# EAGLE design Zio DC-DC Booster (EAGLE 8.7.1)
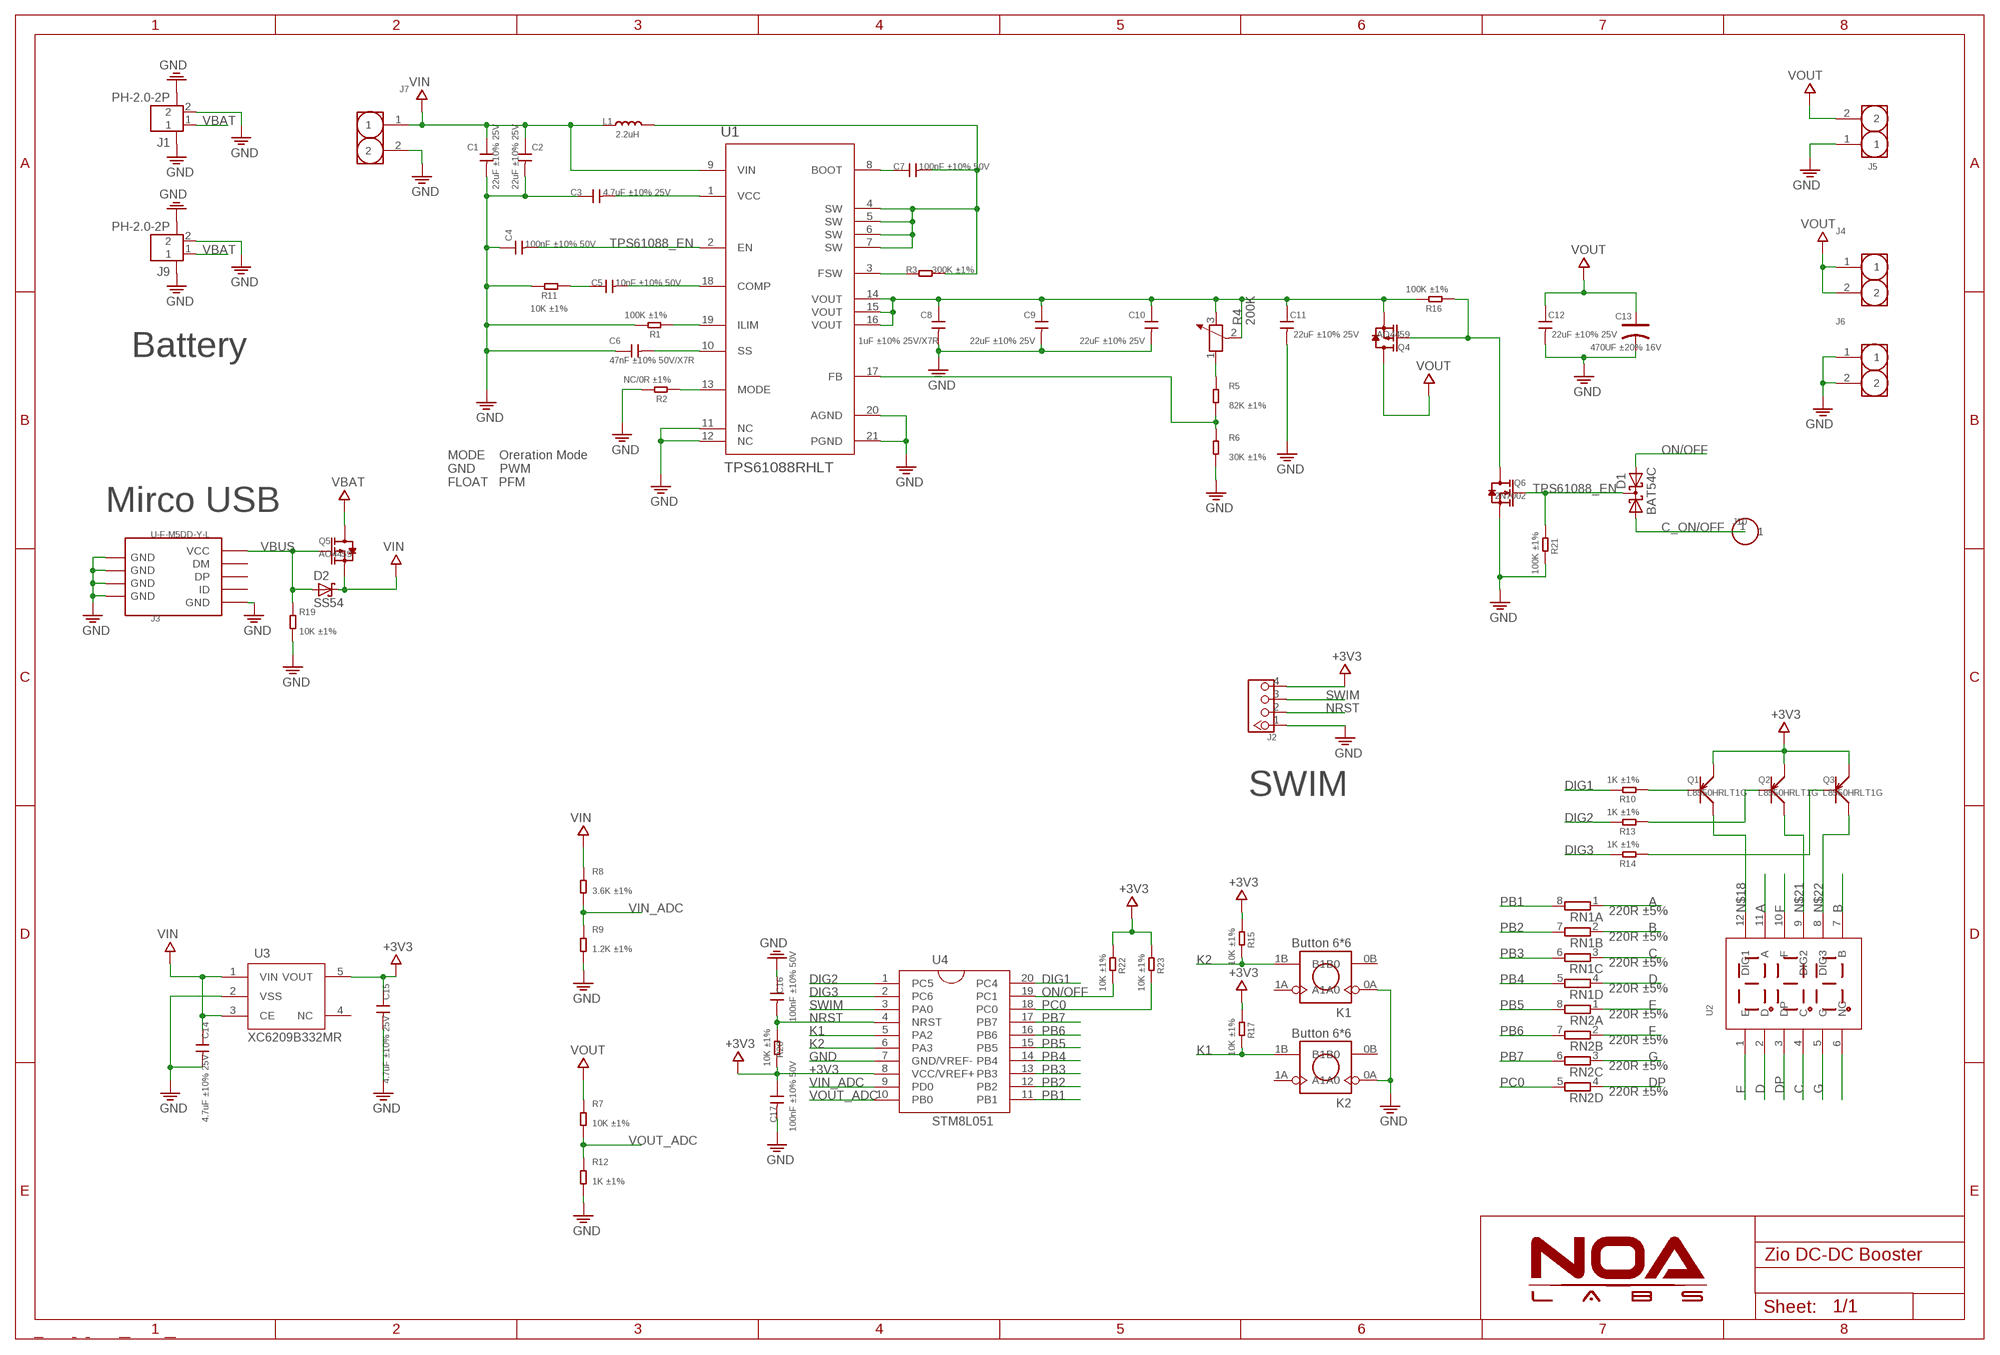
[diagram p0: schematic, sheet 1]

## Parts
C1  22uF ±10% 25V  C-1206  [1206]
C2  22uF ±10% 25V  C-1206  [1206]
C3  4.7uF ±10% 25V  C-0603  [0603]
C4  100nF ±10% 50V  C-0603  [0603]
C5  10nF ±10% 50V  C-0603  [0603]
C6  47nF ±10% 50V/X7R  C-0603  [0603]
C7  100nF ±10% 50V  C-0603  [0603]
C8  1uF ±10% 25V/X7R  C-0603  [0603]
C9  22uF ±10% 25V  C-1206  [1206]
C10  22uF ±10% 25V  C-1206  [1206]
C11  22uF ±10% 25V  C-1206  [1206]
C12  22uF ±10% 25V  C-1206  [1206]
C13  470UF ±20% 16V  CAP-ELECTRO-E  [ELECTRO-SMD-E-7.8MM]
C14  4.7uF ±10% 25V  C-0603  [0603]
C15  4.7uF ±10% 25V  C-0603  [0603]
C16  100nF ±10% 50V  C-0603  [0603]
C17  100nF ±10% 50V  C-0603  [0603]
D1  BAT54C  [SOT23]
D2  SS54  SCHOTTKY  [SMA]
J1  PH-2.0-2P  [PH-2.0-2P]
J2  HEADER-4P-TEST_3.08_4P  [TEST_3.08_4P]
J3  U-F-M5DD-Y-L  USB-MICROE  [MICRO-SMD]
J4  HEADER-2P-65/35MIL  [2P-2.54-65/35MIL]
J5  HEADER-2P-SCREW5.0  [2P-SCREW-5.0]
J6  HEADER-2P-65/35MIL  [2P-2.54-65/35MIL]
J7  HEADER-2P-SCREW5.0  [2P-SCREW-5.0]
J9  PH-2.0-2P  [PH-2.0-2P]
J10  HEADER-1P  [1P-40MIL]
K1  Button 6*6  BOTTON-4P-6X6  [4P-SMD-6X6]
K2  Button 6*6  BOTTON-4P-6X6  [4P-SMD-6X6]
L1  2.2uH  L-10.5*11.5  [L-10.5*11.5]
Q1  L8550HRLT1G  TRANSISTOR-PNP-SOT23  [SOT23]
Q2  L8550HRLT1G  TRANSISTOR-PNP-SOT23  [SOT23]
Q3  L8550HRLT1G  TRANSISTOR-PNP-SOT23  [SOT23]
Q4  AO4459  MOSFET-P-AO4459  [SOP08]
Q5  AO4459  MOSFET-P-AO4459  [SOP08]
Q6  2N7002  MOSFET-N-SOT23  [SOT23]
R1  100K ±1%  R  [0603]
R2  NC/0R ±1%  R-0402  [0402]
R3  300K ±1%  R  [0603]
R4  200K  R-POTENTIOMETER'3362'  [3P-SQUA-7X6.8]
R5  82K ±1%  R  [0603]
R6  30K ±1%  R  [0603]
R7  10K ±1%  R  [0603]
R8  3.6K ±1%  R  [0603]
R9  1.2K ±1%  R  [0603]
R10  1K ±1%  R  [0603]
R11  10K ±1%  R  [0603]
R12  1K ±1%  R  [0603]
R13  1K ±1%  R  [0603]
R14  1K ±1%  R  [0603]
R15  10K ±1%  R  [0603]
R16  100K ±1%  R  [0603]
R17  10K ±1%  R  [0603]
R19  10K ±1%  R  [0603]
R20  10K ±1%  R-0603  [0603]
R21  100K ±1%  R  [0603]
R22  10K ±1%  R  [0603]
R23  10K ±1%  R  [0603]
RN1  220R ±5%  RESISTOR-DIL_4R-N0603-ARC  [RESISTOR-DIL_0603-ARC]
RN2  220R ±5%  RESISTOR-DIL_4R-N0603-ARC  [RESISTOR-DIL_0603-ARC]
U1  TPS61088RHLT  IC_TPS61088RHLR  [IC_RHL0020A]
U2  SEGMENT_ANODES_3_0.28  [SEGMENT_ANODES_3_0.28]
U3  XC6209B332MR  XC6210  [SOT23-5]
U4  STM8L051  [TSSOP20]

## Nets
+3V3: C15.1 C17.1 J2.4 Q1.2(E) Q2.2(E) Q3.2(E) R15.2 R17.2 R20.2 R22.2 R23.2 U3.5(VOUT) U4.8(VCC/VREF+)
A: RN1.1 U2.11(A)
B: RN1.2 U2.7(B)
C: RN1.3 U2.4(C)
C_ON/OFF: D1.1(A1) J10.1
D: RN1.4 U2.2(D)
DIG1: R10.1 U4.20(PC4)
DIG2: R13.1 U4.1(PC5)
DIG3: R14.1 U4.2(PC6)
DP: RN2.4 U2.3(DP)
E: RN2.1 U2.1(E)
F: RN2.2 U2.10(F)
G: RN2.3 U2.5(G)
GND: C1.2 C2.2 C3.1 C4.1 C6.1 C8.2 C9.2 C10.2 C11.2 C12.2 C13.- C14.2 C15.2 C16.1 C17.2 J1.2 J1.7 J1.8 J2.1 J3.GND J3.S1(GND) J3.S1@1(GND) J3.S1@2(GND) J3.S2(GND) J3.S2@1(GND) J3.S2@2(GND) J3.S3(GND) J3.S3@1(GND) J3.S3@2(GND) J3.S4(GND) J3.S4@1(GND) J3.S4@2(GND) J5.1 J6.1 J6.2 J7.2 J9.2 J9.7 J9.8 K1.0A(A0) K2.0A(A0) Q6.2(S) R1.1 R2.1 R6.2 R9.1 R11.1 R12.1 R19.2 R21.1 U1.11(NC) U1.12(NC) U1.20(AGND) U1.21(PGND) U3.2(VSS) U4.7(GND/VREF-)
K1: K2.1B(B1) R17.1 U4.5(PA2)
K2: K1.1B(B1) R15.1 U4.6(PA3)
N$2: R4.1 R5.1
N$3: Q1.1(B) R10.2
N$4: Q2.1(B) R13.2
N$5: Q3.1(B) R14.2
N$6: Q4.4(G) Q6.3(D) R16.2
N$12: C5.1 R11.2
N$13: C5.2 U1.18(COMP)
N$17: U2.6(NC)
N$18: Q1.3(C) U2.12(DIG1)
N$21: Q2.3(C) U2.9(DIG2)
N$22: Q3.3(C) U2.8(DIG3)
N$30: C3.2 U1.1(VCC)
N$32: C7.1 U1.8(BOOT)
N$35: R3.1 U1.3(FSW)
N$38: R5.2 R6.1 U1.17(FB)
N$41: R2.2 U1.13(MODE)
N$43: C6.2 U1.10(SS)
N$45: R1.2 U1.19(ILIM)
NRST: C16.2 J2.2 R20.1 U4.4(NRST)
ON/OFF: D1.2(A2) R22.1 U4.19(PC1)
PB1: RN1.8 U4.11(PB1)
PB2: RN1.7 U4.12(PB2)
PB3: RN1.6 U4.13(PB3)
PB4: RN1.5 U4.14(PB4)
PB5: RN2.8 U4.15(PB5)
PB6: RN2.7 U4.16(PB6)
PB7: RN2.6 U4.17(PB7)
PC0: R23.1 RN2.5 U4.18(PC0)
SW: C7.2 L1.2 R3.2 U1.4(SW) U1.5(SW) U1.6(SW) U1.7(SW)
SWIM: J2.3 U4.3(PA0)
TPS61088_EN: C4.2 D1.3(CC) Q6.1(G) R21.2 U1.2(EN)
V_OUT: C8.1 C9.1 C10.1 C11.1 Q4.1(S) Q4.2(S) Q4.3(S) R4.2 R4.3 R16.1 U1.14(VOUT) U1.15(VOUT) U1.16(VOUT)
VBAT: J1.1 J9.1 Q5.5(D) Q5.6(D) Q5.7(D) Q5.8(D)
VBUS: D2.P$2(A) J3.VBUS(VCC) Q5.4(G) R19.1
VIN: C1.1 C2.1 C14.1 D2.P$1(C) J7.1 L1.1 Q5.1(S) Q5.2(S) Q5.3(S) R8.2 U1.9(VIN) U3.1(VIN) U3.3(CE)
VIN_ADC: R8.1 R9.2 U4.9(PD0)
VOUT: C12.1 C13.+ J4.1 J4.2 J5.2 Q4.5(D) Q4.6(D) Q4.7(D) Q4.8(D) R7.2
VOUT_ADC: R7.1 R12.2 U4.10(PB0)
Unconnected: J3.D+(DP) J3.D-(DM) J3.ID K1.0B(B0) K1.1A(A1) K2.0B(B0) K2.1A(A1) U3.4(NC)

## Notes on the sheet
- Battery
- MODE    Oreration Mode
  GND       PWM
  FLOAT   PFM
- Mirco USB
- SWIM

## Library data of the parts
C1-C12 C14 C15 = Discrete:C*: Ceramic Capacitors
C13 = Discrete:CAP*: Electrolytic Capacitors,Tantalum Capacitors and Super Capacitors
C16 C17 = Discretex:C*: Ceramic Capacitors
D1 = diode:BAT54C: Schottky Diodes Source: Fairchild .. BAT54.pdf
D2 = Discrete:SCHOTTKY
J1 J9 = Connector:PH-2.0-2P
J2 = Connector:HEADER-4P
J3 = Connector:USB-MICROE
J4-J7 = Connector:HEADER-2P
J10 = Connector:HEADER-1P
K1 K2 = Discrete:BOTTON-4P
L1 = Discretex:L*
Q1-Q3 = Discretex:TRANSISTOR-PNP*: PNP audion
Q4 Q5 = Discretex:MOSFET-P
Q6 = Discretex:MOSFET-N
R1-R3 R5-R17 R19 R21-R23 = Discrete:R*
R4 = Discrete:R-POTENTIOMETER*: Potentiometer
R20 = Discretex:R*
RN1 RN2 = A:RESISTOR-DIL_4R-N: Array Chip Resistor Source: RS Component / Phycomp
U1 = IC:IC_TPS61088RHLR; ALTERNATEPARTNUMBER: TPS61088RHLT; APPLICATION_BUILDNUMBER: *; COMPTYPE: IC; MANUFACTURER: Texas Instruments; MOUNTTYPE: SMT; PACKAGEREFERENCE: RHL0020A; PARTNUMBER: TPS61088RHLR; PIN_COUNT: 21; REFDES: RefDes; ROHS: Y; TYPE: TYPE; VALUE: Value
U2 = Discretex:SEGMENT_ANODES_3_0.28
U3 = IC:XC6210
U4 = IC:STM8L051

## Board
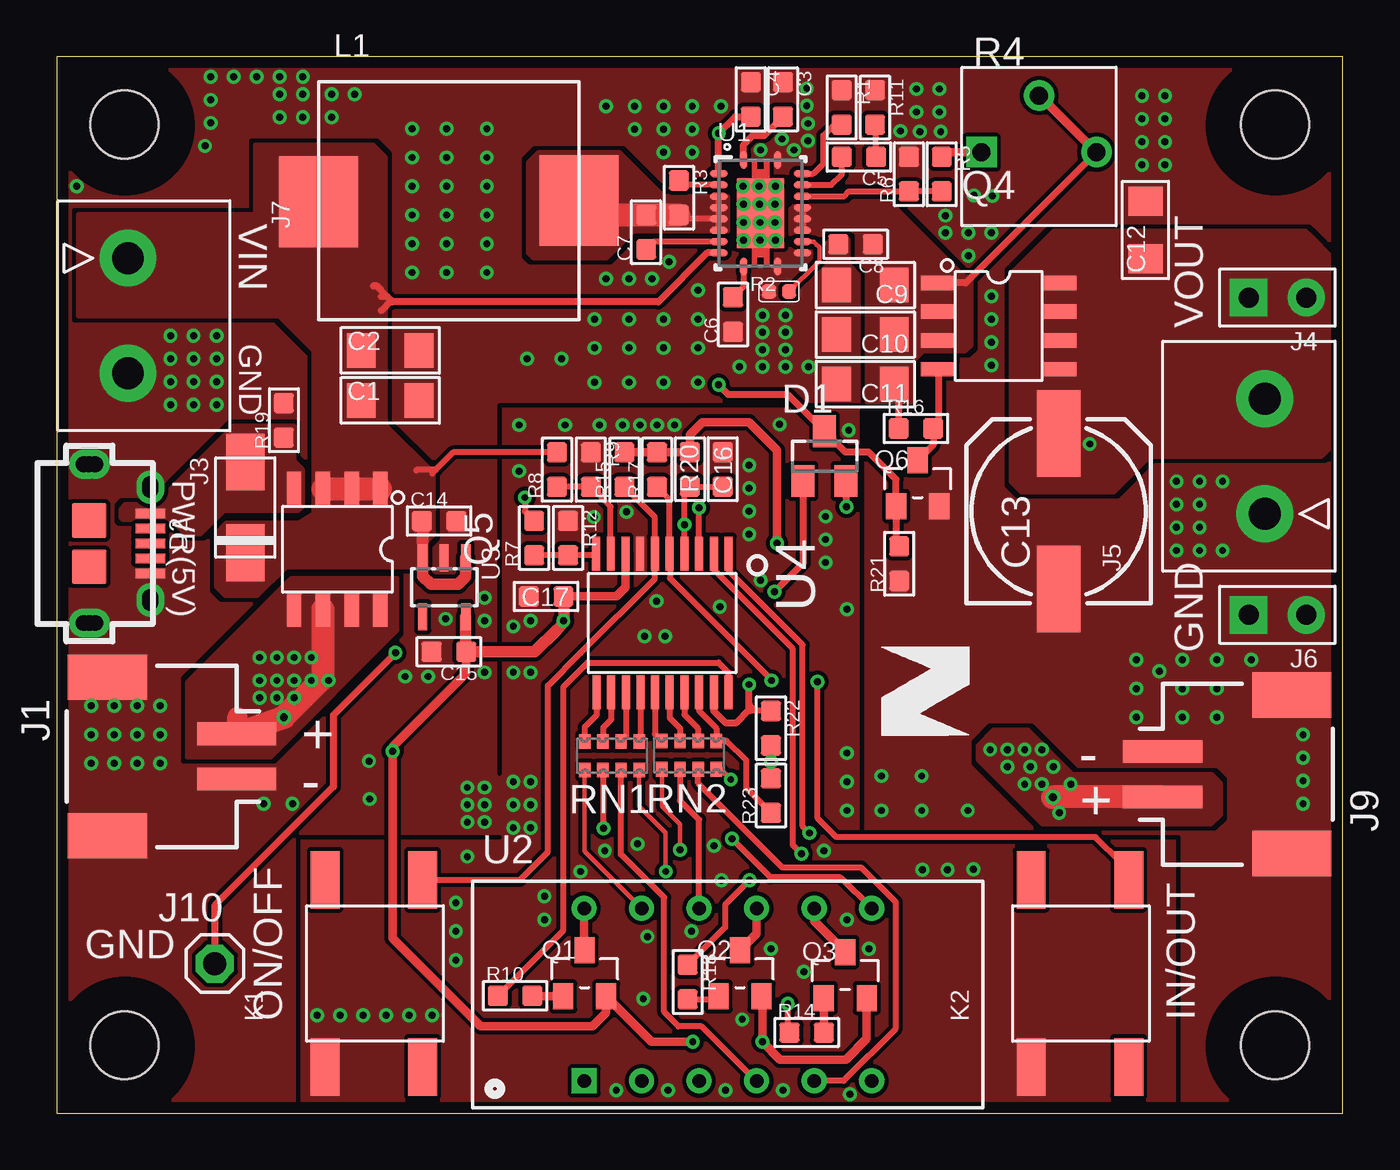
[diagram p1: board, top side]
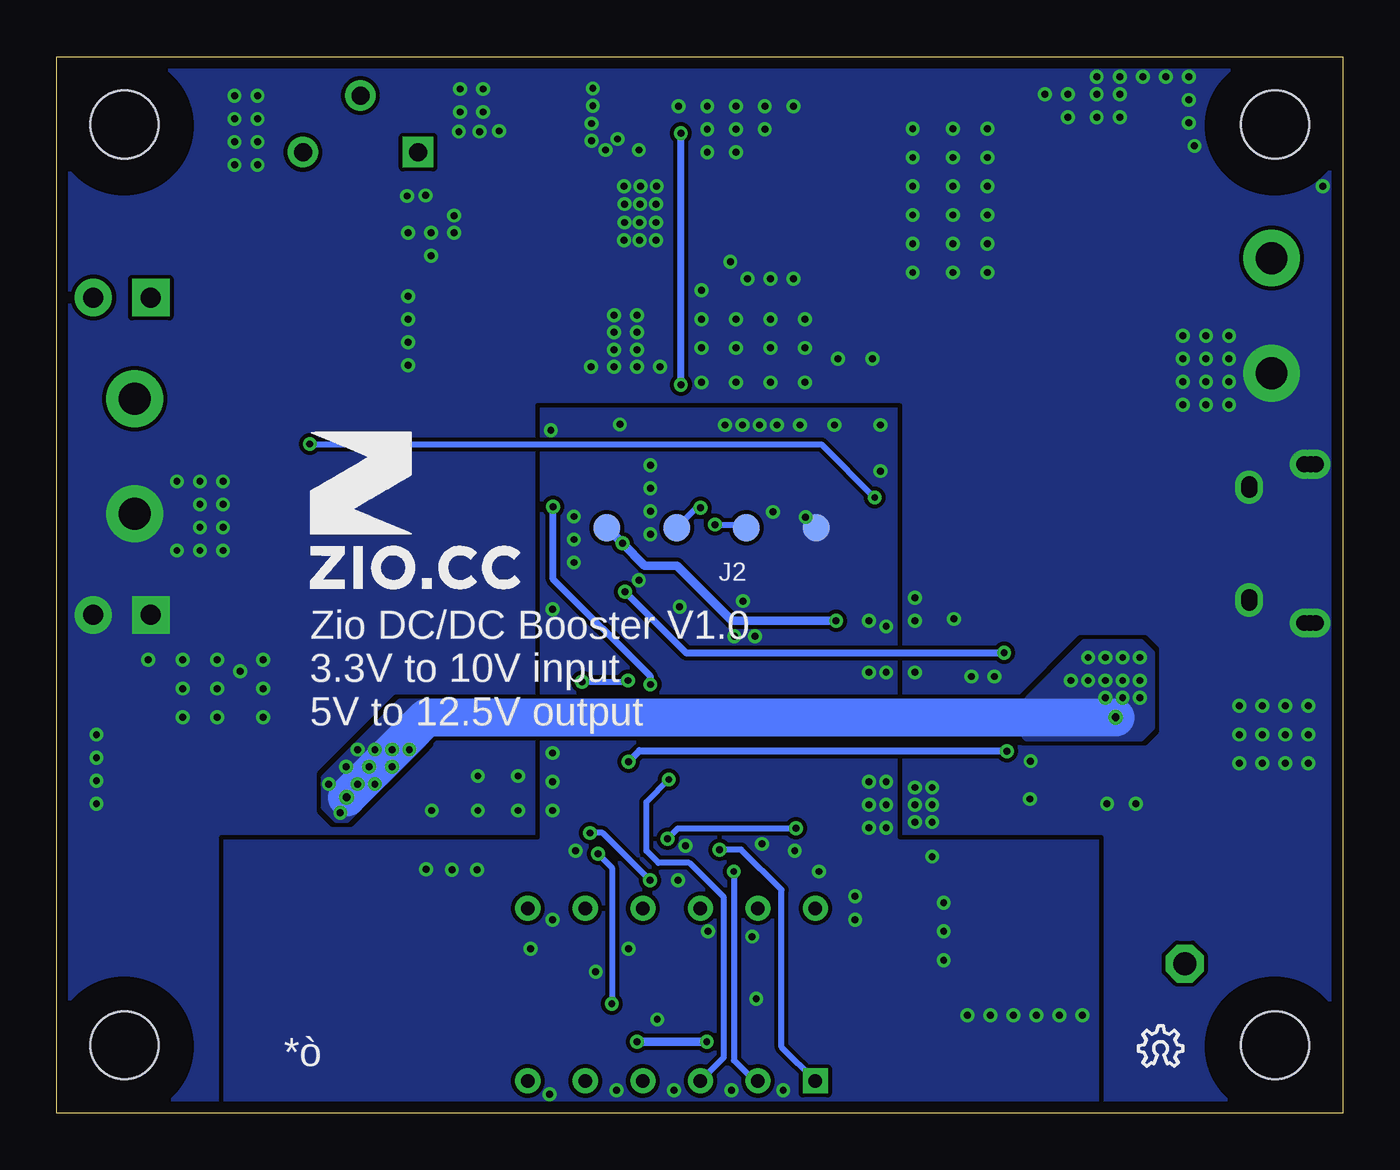
[diagram p2: board, bottom side, seen from below]

Size 56.8 x 46.64 mm. Coordinates in mm from the lower left corner, seen from the top.
Outline: 0,0 56.8,0 56.8,46.64 0,46.64 0,0
Copper layers (1*16): Top 0.035mm / dielectric 1.5mm / Bottom 0.035mm
Design rules "NOA Eagle Rule": minimum track width 7mil, minimum drill 12mil, track to track 7mil, track to pad 7mil, pad to pad 7mil, via to via 7mil, smd to smd 0mil, copper to edge 20mil, drill to drill 10mil, minimum pad ring 10mil, minimum via ring 6mil, stop-mask expansion 2mil, vias tented up to drill 25mil, thermal gap 10mil
Holes 3 mm at 3,3 53.8,3 3,43.64 53.8,43.64
tRestrict: area 0,40.6 to 6,46.6; area 0,-0.1 to 6,5.9; area 50.8,40.6 to 56.8,46.6; area 50.8,-0.1 to 56.8,5.9; 8 lines
bRestrict: area 0,-0.1 to 6,5.9; area 0,40.6 to 6,46.6; area 50.8,40.6 to 56.8,46.6; area 50.8,-0.1 to 56.8,5.9; 8 lines

### Footprints (pad centres in the part's own frame; a part is rotated, then mirrored left to right if it is on the bottom)
1206 = smd 1.27 x 1.524: 1 -1.27,0; 2 1.27,0
0603 = smd 0.889 x 0.889: 1 -0.762,0; 2 0.762,0
ELECTRO-SMD-E-7.8MM = smd 3.81 x 1.905: + 3.429,0; - -3.429,0
SOT23 = smd 1 x 1.4: 1 -0.95,-1.1; 2 0.95,-1.1; 3 0,1.1
SMA = smd 2.5 x 1.7: P$1 -2,0; P$2 2,0
PH-2.0-2P = smd 1 x 3.5: 1 -1,0; 2 1,0 | smd 2 x 3.5: 7 -3.5,-5.7; 8 3.5,-5.7
TEST_3.08_4P = smd 1.2 x 1.2: 1 -4.62,0; 2 -1.54,0; 3 1.54,0; 4 4.62,0
MICRO-SMD = smd 0.406 x 1.346: D+ 0,2.057; D- -0.66,2.057; GND 1.321,2.057; ID 0.66,2.057; VBUS -1.321,2.057 | drill 0.7: S1 -2.489,2.057; S1@1 -2.616,2.057; S1@2 -2.362,2.057; S2 2.464,2.057; S2@1 2.362,2.057; S2@2 2.616,2.057 | drill 0.7 pad 1.27: S3 -3.505,-0.66; S3@1 -3.505,-0.381; S3@2 -3.505,-0.889; S4 3.505,-0.635; S4@1 3.505,-0.381; S4@2 3.505,-0.889 | smd 1.524 x 1.524: S5 -1.016,-0.635; S6 1.016,-0.635
2P-2.54-65/35MIL = drill 0.889 pad 1.651 square: 1 0,1.27 | drill 0.889 pad 1.651: 2 0,-1.27
2P-SCREW-5.0 = drill 1.4 pad 2.5: 1 -2.54,0; 2 2.54,0
1P-40MIL = drill 1.016 pad 1.676 octagon: 1 0,0
4P-SMD-6X6 = smd 2.54 x 1.27: 0A -4.129,2.205; 0B 4.129,2.205; 1A -4.129,-2.105; 1B 4.129,-2.105
L-10.5*11.5 = smd 3.5 x 4: 1 -5.75,-0.05; 2 5.75,0
SOT23' = smd 0.889 x 1.143: 1 -0.95,-1.016; 2 0.95,-1.016; 3 0,1.016
SOP08 = smd 0.635 x 1.524: 1 -1.905,-2.667; 2 -0.635,-2.667; 3 0.635,-2.667; 4 1.905,-2.667; 5 1.905,2.667; 6 0.635,2.667; 7 -0.635,2.667; 8 -1.905,2.667
0402 = smd 0.635 x 0.635: 1 -0.445,0; 2 0.445,0
3P-SQUA-7X6.8 = drill 0.8 pad 1.35 square: 1 -2.54,-0.25 | drill 0.8 pad 1.35: 2 0,2.25; 3 2.54,-0.25
RESISTOR-DIL_0603-ARC = smd 0.5 x 0.65: 1 -1.2,-0.625; 2 -0.4,-0.625; 3 0.4,-0.625; 4 1.2,-0.625; 5 1.2,0.625; 6 0.4,0.625; 7 -0.4,0.625; 8 -1.2,0.625
IC_RHL0020A = smd 0.32 x 0.8: 1 -0.75,2.35; 10 -0.75,-2.35; 11 0.75,-2.35; 20 0.75,2.35 | smd 0.8 x 0.32: 2 -1.85,1.75; 3 -1.85,1.25; 4 -1.85,0.75; 5 -1.85,0.25; 6 -1.85,-0.25; 7 -1.85,-0.75; 8 -1.85,-1.25; 9 -1.85,-1.75; 12 1.85,-1.75; 13 1.85,-1.25; 14 1.85,-0.75; 15 1.85,-0.25; 16 1.85,0.25; 17 1.85,0.75; 18 1.85,1.25; 19 1.85,1.75 | smd 2.083 x 3.048: 21 0,0
SEGMENT_ANODES_3_0.28 = drill 0.6 square: 1 0,0 | drill 0.6: 2 2.54,0; 3 5.08,0; 4 7.62,0; 5 10.16,0; 6 12.7,0; 7 12.7,7.62; 8 10.16,7.62; 9 7.62,7.62; 10 5.08,7.62; 11 2.54,7.62; 12 0,7.62
SOT23-5 = smd 0.4 x 1.2: 1 -0.95,-1.3; 2 0,-1.3; 3 0.95,-1.3; 4 0.95,1.3; 5 -0.95,1.3
TSSOP20 = smd 0.35 x 1.5: 1 -2.925,-3.065; 2 -2.275,-3.065; 3 -1.625,-3.065; 4 -0.975,-3.065; 5 -0.325,-3.065; 6 0.325,-3.065; 7 0.975,-3.065; 8 1.625,-3.065; 9 2.275,-3.065; 10 2.925,-3.065; 11 2.91,3.065; 12 2.26,3.065; 13 1.61,3.065; 14 0.96,3.065; 15 0.325,3.065; 16 -0.325,3.065; 17 -0.975,3.065; 18 -1.625,3.065; 19 -2.275,3.065; 20 -2.925,3.065

### Placement (x,y rotation side)
C1  14.73,31.47 0 top
C2  14.73,33.68 0 top
C3  32.08,44.75 270 top
C4  30.65,44.75 270 top
C5  35.43,42.21 180 top
C6  29.87,35.25 90 top
C7  26.03,38.89 90 top
C8  35.28,38.36 180 top
C9  35.71,36.55 180 top
C10  35.71,34.37 180 top
C11  35.71,32.19 180 top
C12  48.08,38.99 90 top
C13  44.25,26.57 90 top
C14  16.89,26.14 0 top
C15  17.32,20.37 180 top
C16  29.41,28.42 270 top
C17  21.62,22.81 180 top
D1  33.91,29.01 0 top
D2  8.33,26.74 90 top
J1  7.95,15.75 270 top
J2  27.88,25.84 180 bottom
J3  2.08,25.15 270 top
J4  53.91,36 90 top
J5  53.35,29 90 top
J6  53.91,22 90 top
J7  3.15,35.2 270 top
J9  48.84,14.96 90 top
J10  6.99,6.6 0 top
K1  14.06,6.17 90 top
K2  45.24,6.17 90 top
L1  17.32,40.28 0 top
LOGO1  LOGO-OSHW-6MILX0070-NT  [OSHW_6X70_NOTEXT]  9.04,2.08 0 bottom
Q1  L8550HRLT1G  [SOT23']  23.32,6.17 0 top
Q2  L8550HRLT1G  [SOT23']  30.18,6.17 0 top
Q3  L8550HRLT1G  [SOT23']  34.83,6.1 0 top
Q4  41.61,34.75 270 top
Q5  12.4,24.89 180 top
Q6  2N7002  [SOT23']  38.02,27.81 0 top
R1  34.67,44.4 270 top
R2  31.9,36.27 0 top
R3  27.48,40.41 270 top
R4  43.38,42.67 0 top
R5  39.09,41.45 270 top
R6  37.64,41.45 90 top
R7  21.09,25.39 90 top
R8  22.09,28.41 90 top
R9  23.59,28.41 270 top
R10  20.25,5.18 0 top
R11  36.14,44.4 270 top
R12  22.59,25.39 270 top
R13  27.87,5.79 270 top
R14  33.12,3.56 0 top
R15  25.07,28.41 90 top
R16  37.95,30.23 0 top
R17  26.51,28.41 90 top
R19  10.03,30.59 90 top
R20  27.97,28.42 90 top
R21  37.21,24.26 90 top
R22  31.55,16.99 270 top
R23  31.55,14.02 90 top
RN1  24.52,15.78 0 top
RN2  27.93,15.8 0 top
U1  31.09,39.73 0 top
U2  23.29,1.42 0 top
U3  17.12,23.22 180 top
U4  26.75,21.64 180 top
U$2  [6MM]  36.4,16.66 0 top
U$3  [7MM]  45.62,23.16 0 bottom

### Tracks (layer width: path | path; a pad name or v marks a point on that pad's centre or on a via)
+3V3  (via drill 0.3)
  Top 0.305: v22.38,21.74 22.38,21.64 22.11,21.37 | R23.2 v31.55,15.52 R22.2
  Top 0.381: U4.8 25.12,23.22 24.71,22.81 C17.1 | Q2.2 31.17,5.12 v31.17,3.15 31.95,2.36 34.85,2.36 35.76,3.28 35.76,5.07 Q3.2 | v28.09,3.15 26.28,3.15 Q1.2 24.27,4.43 23.67,3.83 18.72,3.83 14.83,7.72 v14.83,15.98 14.83,16.18 18.09,19.43 C15.1 | v31.82,25.16 31.82,29.27 30.58,30.5 28.52,30.5 27.96,29.95 R20.2 26.52,29.18 R17.2 R15.2
  Top 0.508: U3.5 18.07,20.39 C15.1 21.11,20.37 22.11,21.37 22.4,21.67 22.4,22.78 C17.1
  Bottom 0.305: v31.55,15.52 31.06,16 14.86,16 v14.83,15.98
  Bottom 0.381: v31.17,3.15 v28.09,3.15 | J2.4 v31.82,25.16 30.83,24.17 29.41,24.17 26.99,21.74 v22.38,21.74
A
  Top 0.203: RN1.1 23.32,11.55 U2.11
B  (via drill 0.3)
  Top 0.254: RN1.2 24.12,12.61 v24.16,12.57 | v29.82,12.12 31.52,10.41 34.62,10.41 U2.7
  Bottom 0.254: v29.82,12.12 29.36,12.57 v24.16,12.57
C
  Top 0.254: RN1.3 24.92,11.43 26.82,9.53 26.82,4.47 27.46,3.83 28.47,3.83 30.89,1.42 U2.4
C_ON/OFF  (via drill 0.3)
  Top 0.305: D1.1 32.96,24.27 v31.7,23.01 | v14.96,20.32 12.22,17.58 12.22,14.4 6.99,9.17 J10.1
  Bottom 0.305: v31.7,23.01 29.01,20.32 v14.96,20.32
D  (via drill 0.3)
  Top 0.203: v26.9,10.67 26.9,12.37 25.72,13.54 RN1.4
  Bottom 0.254: v26.9,10.67 26.9,2.34 25.99,1.42 U2.2
DIG1
  Top 0.254: U4.20 29.67,19.45 29.23,19.89 23.44,19.89 22.38,18.82 22.38,8.08 R10.1
DIG2  (via drill 0.3)
  Top 0.254: U4.1 29.67,23.95 32.94,20.68 32.94,12.68 v33.25,12.37 | v30.6,10.28 29.52,9.2 29.52,8.2 R13.1
  Bottom 0.254: v30.6,10.28 32.69,12.37 v33.25,12.37
DIG3  (via drill 0.3)
  Top 0.254: v32.28,4.83 32.28,3.63 R14.1 | U4.2 29.02,23.99 32.51,20.5 32.51,11.84 v32.89,11.46
  Bottom 0.254: v32.89,11.46 32.28,10.85 v32.28,4.83
DP  (via drill 0.3)
  Top 0.254: v29.77,14.73 29.32,15.18 RN2.4
  Bottom 0.254: U2.3 27.33,2.47 27.33,9.53 28.85,11.05 30.23,11.05 30.76,11.58 30.76,13.74 v29.77,14.73
E  (via drill 0.3)
  Top 0.203: RN2.1 26.73,13.56 27.53,12.75 v27.53,11.63
  Bottom 0.254: U2.1 24.79,2.92 24.79,9.86 26.57,11.63 v27.53,11.63
F
  Top 0.254: RN2.2 27.53,13.8 28.37,12.95 28.37,9.37 U2.10
G
  Top 0.254: RN2.3 28.33,14.57 32.05,10.85 35.53,10.85 37.06,9.32 37.06,3.73 34.75,1.42 U2.5
GND  (via drill 0.3)
  other vias: 39.04,43.33 37.26,43.36 38.13,43.33 25.91,5.05 26.09,7.8 30.28,4.14 35.86,7.26 31.55,7.26 30.33,40.13 31.04,40.13 31.72,40.13 31.72,39.32 31.06,39.32 30.33,39.32 30.33,38.53 31.06,38.53 31.75,38.53 30.3,40.92 31.01,40.92 31.75,40.92 33.17,42.93 33.17,43.69 13.79,15.54 13.82,13.87 38.23,10.74 39.34,10.74 40.49,10.77 11.51,4.32 40.51,40.51 41.33,40.49 29.36,10.29 24.21,11.58 29.03,11.81 21.54,9.58 21.54,8.53 23.14,10.67 25.17,26.54 32.99,6.25 25.65,11.89 18.9,12.85 18.9,13.61 18.9,14.38 18.14,14.38 18.14,13.61 18.14,12.85 20.17,14.63 20.93,14.63 20.93,13.61 20.93,12.6 20.17,12.6 20.17,13.61 20.17,19.46 20.93,19.46 24.99,30.38 25.76,30.38 26.52,30.38 27.28,30.38 30.58,28.6 30.58,27.58 30.58,26.57 30.58,25.55 34.9,22.25 34.9,15.9 34.9,14.63 34.9,13.36 33.88,11.58 34.9,8.53 28.04,8.03 31.09,23.52 18.9,19.46 18.9,21.74 19,43.46 19,42.19 19,40.92 19,39.65 19,38.38 19,37.11 1.52,17.98 2.54,17.98 3.56,17.98 4.57,17.98 4.57,16.71 3.56,16.71 2.54,16.71 1.52,16.71 1.52,15.44 2.54,15.44 3.56,15.44 4.57,15.44 9.14,13.67 10.41,13.67 17.22,43.46 17.22,42.19 17.22,40.92 17.22,39.65 17.22,38.38 17.22,37.11 15.7,43.46 15.7,42.19 15.7,40.92 15.7,39.65 15.7,38.38 15.7,37.11 15.39,19.28 16.41,19.28 17.17,21.82 18.9,22.76 20.17,21.49 20.93,21.74 55.04,14.68 55.04,13.67 47.68,20.02 47.68,18.75 47.68,17.48 49.71,17.48 49.71,18.75 51.23,17.48 55.04,15.7 55.04,16.71 26.49,22.61 29.29,22.35 28.07,42.42 26.8,42.42 33.12,44.48 33.12,45.24 31.17,35.23 32.18,35.23 31.17,34.47 31.17,33.71 32.18,34.47 32.18,33.71 10.87,43.97 10.87,44.98 9.86,44.98 9.86,43.97 49.45,27.89 49.45,26.87 49.45,25.86 49.45,24.84 50.47,24.84 50.47,25.86 50.47,26.87 50.47,27.89 51.49,27.89 51.49,24.84 25.96,21.06 26.87,21.06 32.03,43 32.56,42.52 31.09,42.52 31.17,32.94 32.18,32.94 30.15,32.94 33.2,32.94 5.03,34.32 6.05,34.32 7.06,34.32 7.06,33.3 7.06,32.28 7.06,31.27 6.05,33.3 5.03,33.3 5.03,32.28 6.05,32.28 6.05,31.27 5.03,31.27 10.87,45.75 9.86,45.75 8.84,45.75 7.82,45.75 6.81,45.75 6.81,44.73 6.81,43.71 6.55,42.7 12.14,44.98 13.16,44.98 12.14,43.97 0.89,40.92 36.42,13.36 38.2,13.36 40.23,13.36 36.42,14.88 38.2,14.88 20.78,33.3 22.3,33.3 31.93,30.4 34.98,30.15 33.96,26.34 33.96,25.32 33.96,24.31 12.52,4.32 13.54,4.32 14.55,4.32 15.57,4.32 16.59,4.32 24.71,1.02 27,1.02 29.54,1.02 32.08,1.02 35.03,0.84 28.07,43.43 26.8,43.43 25.53,43.43 28.07,44.45 26.8,44.45 25.53,44.45 24.26,44.45 29.34,44.45 27.05,37.59 26.29,36.83 25.27,36.83 24.26,36.83 28.32,36.32 28.32,35.05 28.32,33.78 28.32,32.26 26.8,32.26 26.8,33.78 26.8,35.05 25.27,35.05 23.75,35.05 25.27,33.78 25.27,32.26 23.75,33.78 23.75,32.26 40.26,37.85 40.26,38.86 39.24,38.86 39.24,39.62 41.27,38.86 41.27,33.02 41.27,34.04 41.27,35.05 41.27,36.07 38.99,44.2 38.99,45.21 37.97,45.21 37.97,44.2 51.23,18.75 49.71,20.02 51.23,20.02 52.76,20.02 48.69,19.51 47.93,41.86 47.93,42.88 47.93,43.89 47.93,44.91 48.95,44.91 48.95,43.89 48.95,42.88 48.95,41.86 23.98,30.38 22.45,30.38 20.42,30.38 20.42,28.35 23.72,26.31 18.14,11.33 17.63,9.3 17.63,8.03 17.63,6.76
  pour Top (rank 2, no thermals): 0,46.63 56.79,46.63 56.79,0 0,0
  pour Bottom (rank 2, no thermals): 0,46.63 56.79,46.63 56.79,0 0,0
K1  (via drill 0.3)
  Top 0.254: 46.99,10.93 K2.1B | K2.1B 46.99,10.85 | R17.1 27.07,27.09 U4.5 27.08,23.62 31.57,19.13 v31.57,19.1 | K2.1B 46.99,11.08 45.87,12.19 34.44,12.19 33.6,13.03 v33.6,19.05
  Bottom 0.254: v33.6,19.05 31.62,19.05 v31.57,19.1
K2
  Top 0.254: U4.6 | K1.1B 20.46,10.3 21.69,11.53 21.69,18.87 23.14,20.32 26.42,23.6 U4.6 | U4.6 26.42,26.3 R15.1
N$2
  Top 0.381: R5.1 39.29,42.42 R4.1
N$3
  Top 0.381: Q1.1 21.03,5.16 R10.2
N$4
  Top 0.254: R13.2 29.1,5.03 Q2.1
N$5
  Top 0.381: Q3.1 R14.2
N$6
  Top 0.305: Q4.4 38.94,30.45 R16.2 38.71,29.52 Q6.3
N$12
  Top 0.254: C5.1 36.19,43.59 R11.2
N$13
  Top 0.254: 34.49,41.99 C5.2 34.67,41.43 34.21,40.98 U1.18
N$18
  Top 0.381: U2.12 23.29,7.21 Q1.3
N$21
  Top 0.381: U2.9 30.91,7.93 Q2.3
N$22
  Top 0.381: U2.8 33.45,8.48 Q3.3
N$30
  Top 0.305: U1.1 30.34,42.76 30.73,43.16 31.24,43.16 C3.2
N$32
  Top 0.254: U1.8 26.38,38.48 C7.1
N$35
  Top 0.254: U1.3 27.68,40.98 R3.1
N$38
  Top 0.254: R5.2 R6.1 | R6.1 37.38,40.95 | U1.17 34.76,40.48 34.98,40.69 R6.1
N$41
  Top 0.203: U1.13 33.43,38.48 33.54,38.37 33.68,38.23 33.68,37.61 33.57,37.5 R2.2
  Top 0.254: U1.13 33.23,38.48
N$43
  Top 0.254: U1.10 30.34,36.49 C6.2
N$45
  Top 0.254: U1.19 33.42,41.48 33.86,41.91 33.86,43.16 34.34,43.64 R1.2
NRST  (via drill 0.3)
  Top 0.254: C16.2 R20.1 27.72,27.42 v27.72,25.98 U4.4
  Bottom 0.254: v27.72,25.98 26.48,25.98 J2.2
ON/OFF  (via drill 0.3)
  Top 0.254: U4.19 29.02,17.74 | R22.1 30.89,17.75 | 30.89,17.75 30.63,17.75 30.58,17.8 | 30.89,17.75 30.58,18.06
  Top 0.305: U4.19 29.02,17.75 29.53,17.25 30.02,17.25 30.58,17.8 30.58,18.06 v30.58,18.92 | v34.87,26.77 34.87,27.89 D1.2
  Bottom 0.305: v30.58,18.92 30.58,19.28 34.87,23.57 v34.87,26.77
PB1
  Top 0.254: U4.11 23.84,17.56 23.32,17.04 RN1.8
PB2
  Top 0.254: U4.12 24.49,17.37 24.13,17.02 RN1.7
PB3
  Top 0.254: U4.13 25.14,16.62 RN1.6
PB4
  Top 0.254: U4.14 25.79,16.47 RN1.5
PB5
  Top 0.254: U4.15 26.42,16.73 RN2.8
PB6
  Top 0.254: U4.16 27.07,17.45 27.53,16.99 RN2.7
PB7
  Top 0.254: U4.17 27.72,17.59 28.32,16.99 RN2.6
PC0
  Top 0.203: RN2.5
  Top 0.254: U4.18 28.37,17.75 29.13,16.99 RN2.5 29.59,16.44 30.45,15.57 30.45,14.35 R23.1
SW
  Top 0.254: U1.4 U1.7 | U1.6 27.65,39.48 R3.2
  Top 1.016: R3.2 C7.2 22.74,39.65
  pour Top (no thermals): 21.29,42.42 24.87,42.42 26.8,40.49 29.64,40.49 29.64,38.94 25.48,38.94 24.28,37.74 21.06,37.74 20.83,37.97 20.83,41.96
SWIM  (via drill 0.3)
  Top 0.254: U4.3 v28.37,26.72
  Bottom 0.254: v28.37,26.72 28.55,26.72 J2.3
TPS61088_EN  (via drill 0.3)
  Top 0.305: U1.2 v29.24,43.26 29.97,43.99 C4.2 | R21.2 37.07,25.16 Q6.1 37.07,27.98 35.87,29.18 34.83,29.18 D1.3 32.29,31.73 29.67,31.73 v29.23,32.16
  Bottom 0.305: v29.24,43.26 v29.23,43.26 v29.23,32.16
V_OUT
  Top 0.305: U1.14 U1.15 U1.16 | R16.1 37.19,31.98 C11.1 | R4.3 40.15,36.65 Q4.1
  Top 0.381: R4.2 43.42,44.92 R4.3
  pour Top (no thermals): 33.5,40.08 35,40.08 35.18,40.26 36.75,40.26 37.11,39.9 40.08,36.93 40.39,36.93 40.39,33.91 40.11,33.63 38.25,33.63 37.95,33.32 37.82,33.2 37.82,31.39 35.79,31.39 35.79,37.29 35.33,37.74 35.33,38.81 35.15,38.99 33.99,38.99 33.78,38.79 32.41,38.79 32.41,39.93 32.46,39.98 32.56,40.08
VBAT  (via drill 0.3, 0.35)
  Top 0.889: J1.1 7.97,17.5
  Top 1.016: J1.1 v10.04,17.48 11.76,19.2 Q5.6 | J9.1 44.01,13.96 v43.99,13.95
  Bottom 0.203: v41.22,16.05 41.22,16.71 40.46,17.48
  Bottom 1.676: v43.99,13.95 40.46,17.48 v10.04,17.48
  other vias: 41.99,16.05 42.75,16.05 41.99,15.29 42.75,14.53 43,15.29 44.02,15.29 44.78,14.53 44.27,13.26 43.51,14.53 43.51,16.05 8.97,20.12 9.73,20.12 10.49,20.12 11.25,20.12 8.97,19.1 9.73,19.1 10.49,19.1 11.25,19.1 12.01,19.1 8.97,18.34 9.73,18.34 10.49,18.34
  pour Top (no thermals): 50.98,12.75 43.54,12.75 40.69,15.6 40.69,16.23 41.38,16.92 42.9,16.92 44.86,14.96 51,14.96 51.36,14.61 51.41,14.55 51.41,13.31 51.41,13.18
  pour Bottom (no thermals): 40.44,18.21 41.66,18.21 45.03,14.83 45.03,13.49 44.45,12.9 43.97,12.9 40.69,16.18 40.44,16.43
  pour Bottom (no thermals): 14.22,18.03 11.43,20.83 8.89,20.83 8.38,20.32 8.38,17.02 8.89,16.51 13.97,16.51 14.22,16.76
  pour Top (no thermals): 5.77,15.72 9.45,15.72 15.04,21.31 15.04,23.62 10.36,23.62 9.63,22.89 5.77,19.02
VBUS
  pour Top (no thermals): 3.02,26.87 4.34,26.87 7.82,30.35 10.49,30.35 10.49,28.8 10.87,28.42 10.87,26.8 10.67,26.59 7.39,26.59 6.35,25.55 5.69,25.55 5.05,26.19 2.92,26.19 2.82,26.29 2.82,26.67
VIN
  Top 0.254: 16.74,28.4 17.51,29.17 R8.2 | 16.74,28.4 16.59,28.25 | 16.74,28.4 15.9,28.4 15.88,28.37
  Top 0.305: U1.9 28.73,37.98 26.57,35.81 14.83,35.81 | 11.43,41.48 11.43,39.62 11.57,39.77 L1.1 | 14.83,35.81 14.61,36.04 | 14.61,36.04 14.35,36.04 | 14.83,35.81 14.73,35.81 14.35,35.43 | 14.61,36.04 14.12,36.52 13.99,36.52
  Top 0.508: U3.1 18.07,23.68 17.73,23.34 16.54,23.34 16.17,23.71 U3.3 16.17,25.82 C14.1
  Top 1.016: Q5.3 Q5.2 Q5.1
  pour Top (no thermals): 7.04,23.24 7.04,25.6 7.49,26.06 10.67,26.06 11.35,26.49 11.35,33.66 9.83,35.18 0.97,35.18 0.97,39.67 8.76,39.67 8.76,42.75 13.97,42.75 14.53,42.19 14.53,30.38 16.64,28.27 16.64,25.53 16.26,25.15 16.26,24.1 10.13,24.1 8.86,22.83 7.44,22.83
VIN_ADC
  Top 0.254: U4.9 24.47,26.77 R9.2 R8.1
VOUT  (via drill 0.3)
  Top 0.254: v20.68,27.18 20.68,26.56 R7.2
  Bottom 0.254: v20.68,27.18 23.01,29.52 45.59,29.52 v45.62,29.54
  pour Top (no thermals): 42.14,37.06 42.14,27.86 42.6,27.41 46.69,27.41 48.26,28.98 55.85,28.98 56.34,29.46 56.34,37.77 55.37,38.73 55.14,38.96 46.3,38.96 44.04,38.96
VOUT_ADC
  Top 0.254: U4.10 23.74,24.63 R12.2 R7.1

### Text on the board
tPlace: VIN | VOUT | GND | PWR(5V) | GND | + | - | - | + | GND | ON/OFF | IN/OUT
bPlace: Zio DC/DC Booster V1.0 / 3.3V to 10V input / 5V to 12.5V output | *ò